# Altium schematic sheet 连接.SchDoc
size A4
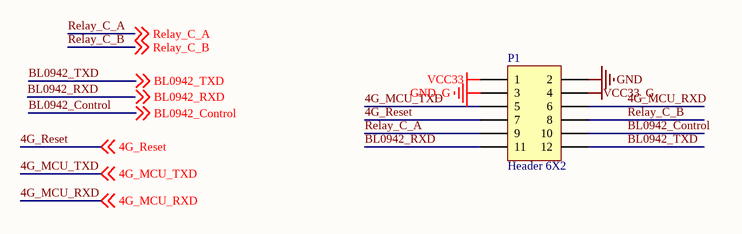
[diagram p0: 连接.SchDoc]

## Parts
P1  Header 6X2  [HDR2X6]

## Nets
GND: P1.2
GND_G: P1.3
VCC33: P1.1
VCC33_G: P1.4
4G_MCU_RXD: P1.6 ; off-sheet 4G_MCU_RXD
4G_MCU_TXD: P1.5 ; off-sheet 4G_MCU_TXD
4G_Reset: P1.7 ; off-sheet 4G_Reset
BL0942_Control: P1.10 ; off-sheet BL0942_Control
BL0942_RXD: P1.11 ; off-sheet BL0942_RXD
BL0942_TXD: P1.12 ; off-sheet BL0942_TXD
Relay_C_A: P1.9 ; off-sheet Relay_C_A
Relay_C_B: P1.8 ; off-sheet Relay_C_B

## Notes on the sheet
- Labels drawn without touching a wire or pin: BL0942_RXD

## Library data of the parts
P1 = Header 6X2: Header, 6-Pin, Dual row; LatestRevisionDate: 17-Jul-2002; LatestRevisionNote: Re-released for DXP Platform.; Publisher: Altium Limited